# EAGLE design TWI-Verteiler (EAGLE 6.4)
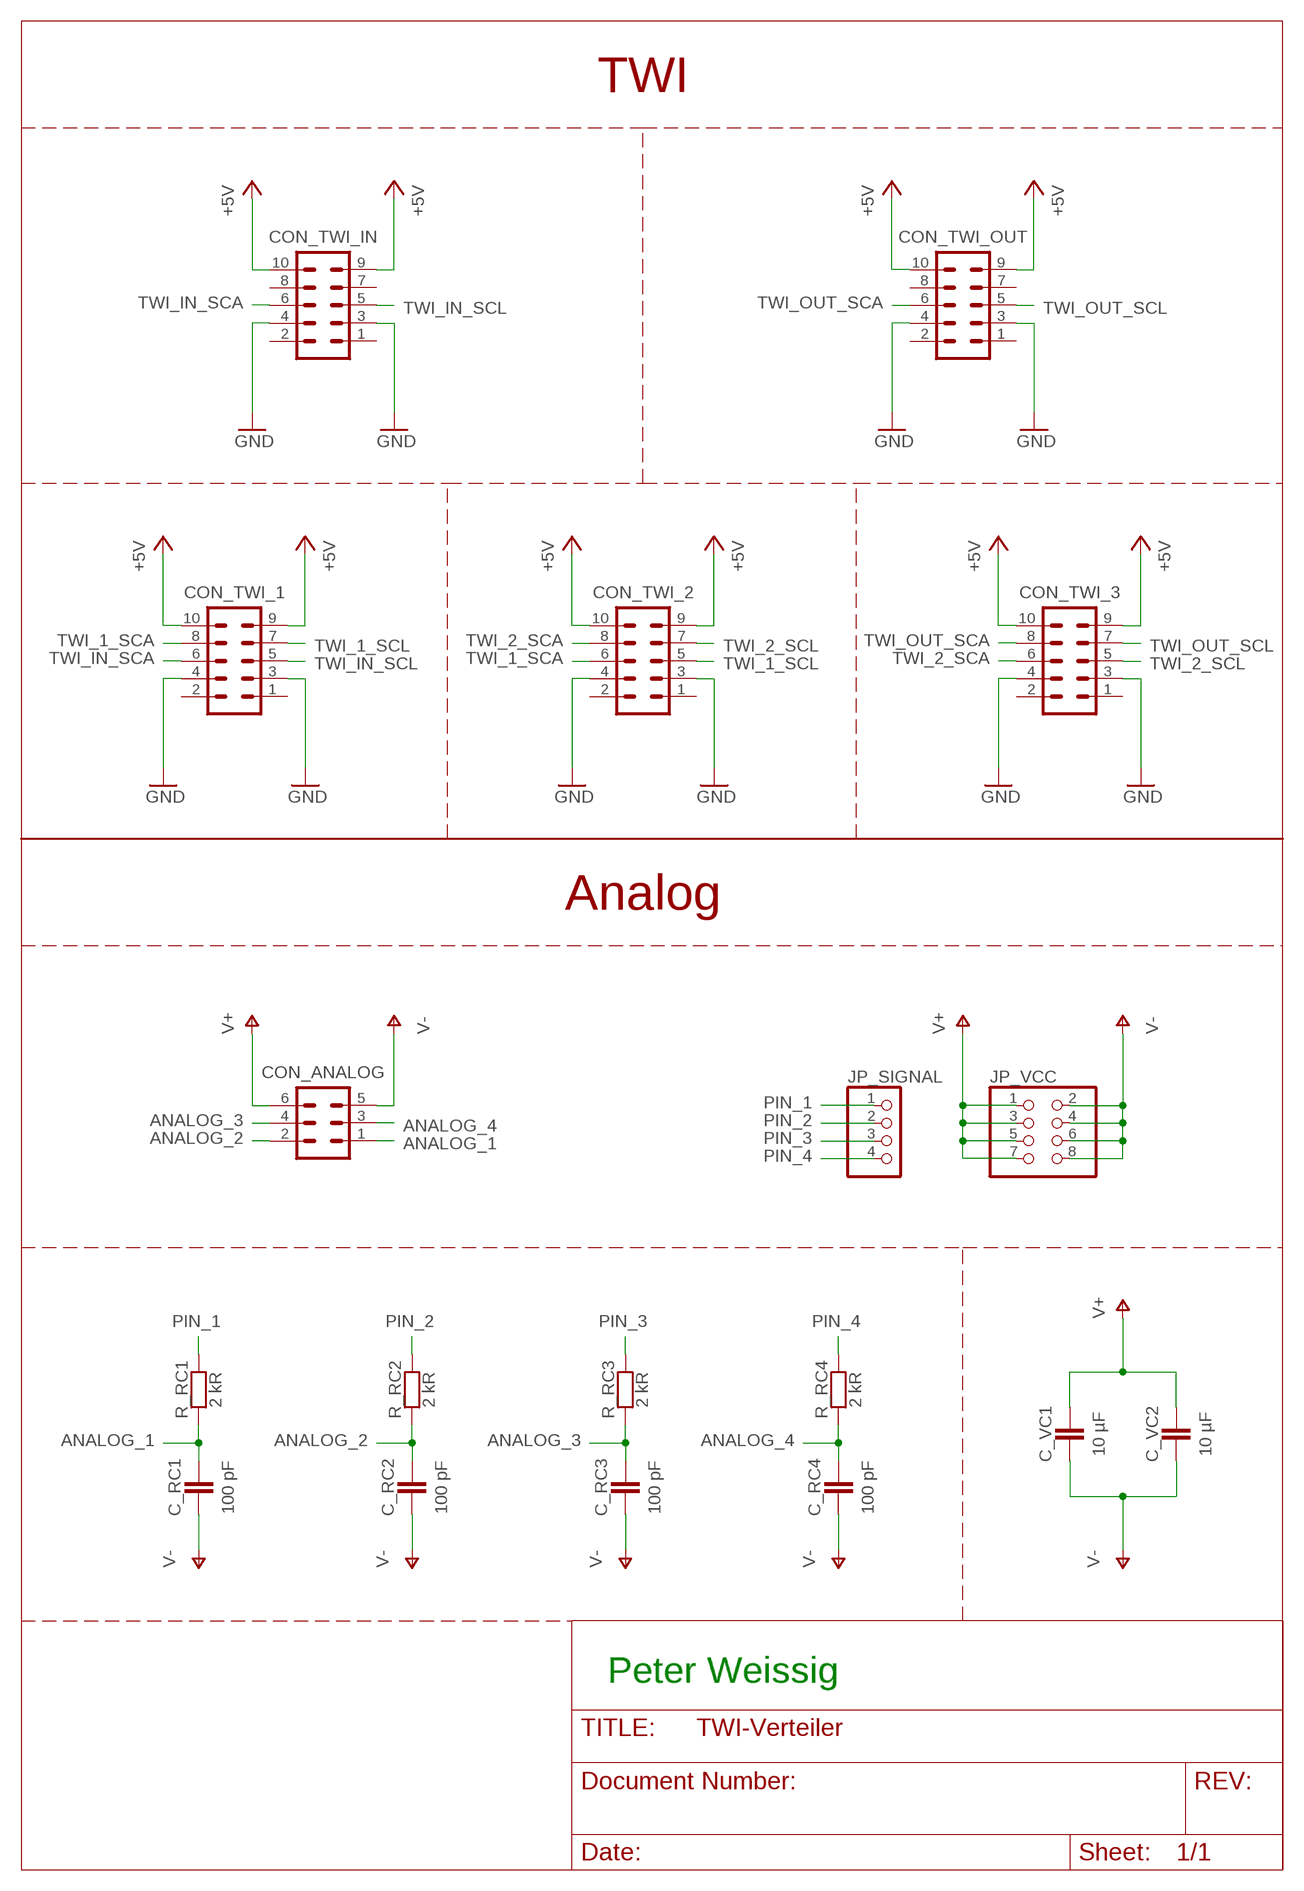
[diagram p0: schematic, sheet 1]

## Parts
C_RC1  100 pF  CAPACITATOR-0603  [SMD_0603]
C_RC2  100 pF  CAPACITATOR-0603  [SMD_0603]
C_RC3  100 pF  CAPACITATOR-0603  [SMD_0603]
C_RC4  100 pF  CAPACITATOR-0603  [SMD_0603]
C_VC1  10 µF  CAPACITATOR-0603  [SMD_0603]
C_VC2  10 µF  CAPACITATOR-0603  [SMD_0603]
CON_ANALOG  STECKER_WANNE_6  [STECKER_WANNE_6]
CON_TWI_1  STECKER_WANNE_10  [STECKER_WANNE_10]
CON_TWI_2  STECKER_WANNE_10  [STECKER_WANNE_10]
CON_TWI_3  STECKER_WANNE_10  [STECKER_WANNE_10]
CON_TWI_IN  STECKER_WANNE_10  [STECKER_WANNE_10]
CON_TWI_OUT  STECKER_WANNE_10  [STECKER_WANNE_10]
JP_SIGNAL  PINHD-1X4  [1X04]
JP_VCC  PINHD-2X4  [2X04]
R_RC1  2 kR  RESISTOR-0603  [SMD_0603]
R_RC2  2 kR  RESISTOR-0603  [SMD_0603]
R_RC3  2 kR  RESISTOR-0603  [SMD_0603]
R_RC4  2 kR  RESISTOR-0603  [SMD_0603]

## Nets
+5V: CON_TWI_1.9 CON_TWI_1.10 CON_TWI_2.9 CON_TWI_2.10 CON_TWI_3.9 CON_TWI_3.10 CON_TWI_IN.9 CON_TWI_IN.10 CON_TWI_OUT.9 CON_TWI_OUT.10
ANALOG_1: C_RC1.1 CON_ANALOG.1 R_RC1.2
ANALOG_2: C_RC2.1 CON_ANALOG.2 R_RC2.2
ANALOG_3: C_RC3.1 CON_ANALOG.4 R_RC3.2
ANALOG_4: C_RC4.1 CON_ANALOG.3 R_RC4.2
GND: CON_TWI_1.3 CON_TWI_1.4 CON_TWI_2.3 CON_TWI_2.4 CON_TWI_3.3 CON_TWI_3.4 CON_TWI_IN.3 CON_TWI_IN.4 CON_TWI_OUT.3 CON_TWI_OUT.4
PIN_1: JP_SIGNAL.1 R_RC1.1
PIN_2: JP_SIGNAL.2 R_RC2.1
PIN_3: JP_SIGNAL.3 R_RC3.1
PIN_4: JP_SIGNAL.4 R_RC4.1
TWI_1_SCA: CON_TWI_1.8 CON_TWI_2.6
TWI_1_SCL: CON_TWI_1.7 CON_TWI_2.5
TWI_2_SCA: CON_TWI_2.8 CON_TWI_3.6
TWI_2_SCL: CON_TWI_2.7 CON_TWI_3.5
TWI_IN_SCA: CON_TWI_1.6 CON_TWI_IN.6
TWI_IN_SCL: CON_TWI_1.5 CON_TWI_IN.5
TWI_OUT_SCA: CON_TWI_3.8 CON_TWI_OUT.6
TWI_OUT_SCL: CON_TWI_3.7 CON_TWI_OUT.5
V+: C_VC1.1 C_VC2.1 CON_ANALOG.6 JP_VCC.1 JP_VCC.3 JP_VCC.5 JP_VCC.7
V-: C_RC1.2 C_RC2.2 C_RC3.2 C_RC4.2 C_VC1.2 C_VC2.2 CON_ANALOG.5 JP_VCC.2 JP_VCC.4 JP_VCC.6 JP_VCC.8
Unconnected: CON_TWI_1.1 CON_TWI_1.2 CON_TWI_2.1 CON_TWI_2.2 CON_TWI_3.1 CON_TWI_3.2 CON_TWI_IN.1 CON_TWI_IN.2 CON_TWI_IN.7 CON_TWI_IN.8 CON_TWI_OUT.1 CON_TWI_OUT.2 CON_TWI_OUT.7 CON_TWI_OUT.8

## Notes on the sheet
- TWI
- Analog
- Peter Weissig

## Library data of the parts
C_RC1-C_RC4 C_VC1 C_VC2 = robo_ag:CAPACITATOR: Kondensator
CON_ANALOG = robo_ag:STECKER_WANNE_6: Stecker; REICHELT: WSL 6G
CON_TWI_1-CON_TWI_3 CON_TWI_IN CON_TWI_OUT = robo_ag:STECKER_WANNE_10: Stecker; REICHELT: WSL 10G
JP_SIGNAL = pinhead:PINHD-1X4: PIN HEADER
JP_VCC = pinhead:PINHD-2X4: PIN HEADER
R_RC1-R_RC4 = robo_ag:RESISTOR: Widerstand

## Board
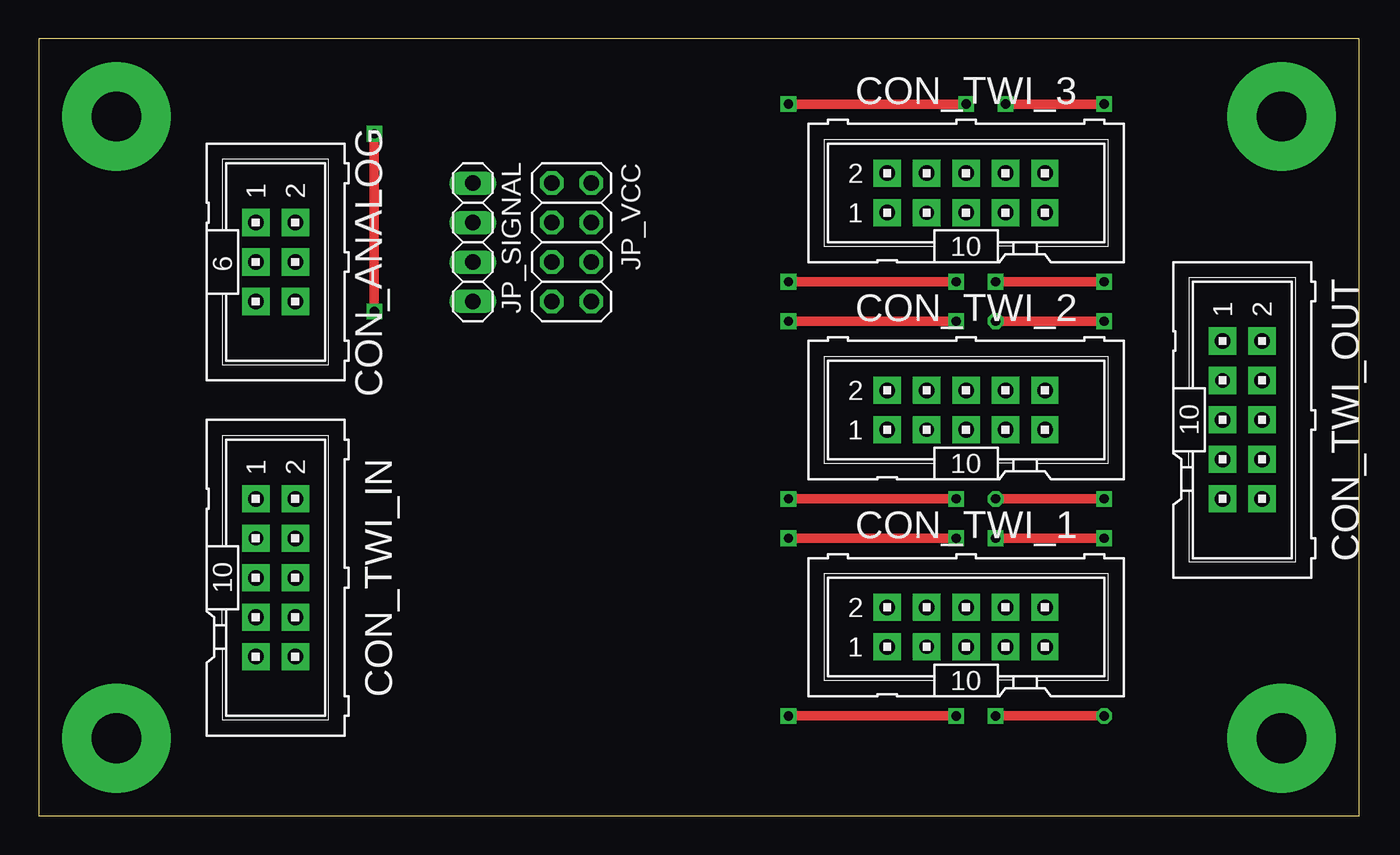
[diagram p1: board, top side]
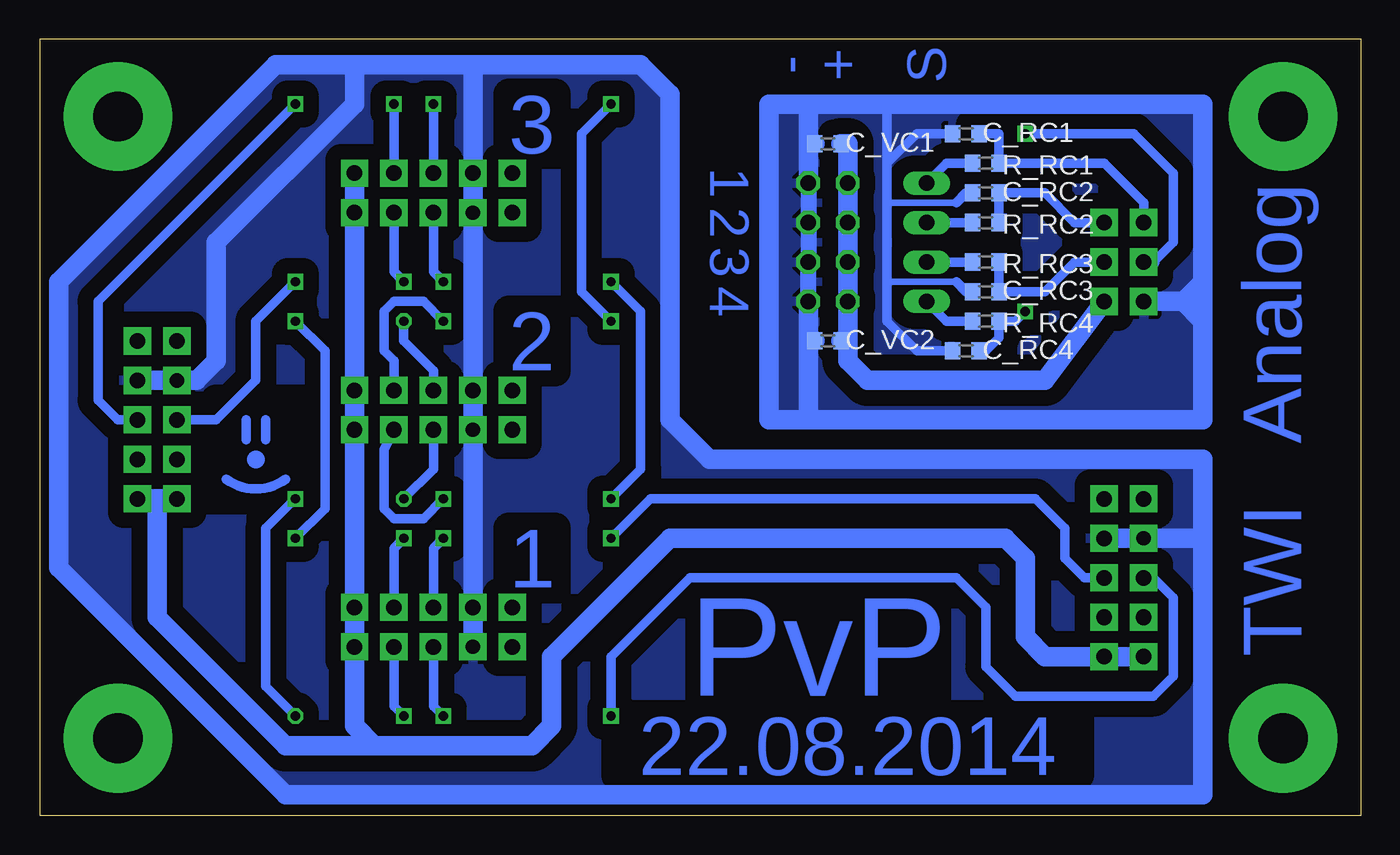
[diagram p2: board, bottom side, seen from below]

Size 85 x 50 mm. Coordinates in mm from the lower left corner, seen from the top.
Outline: 0,0 85,0 85,50 0,50 0,0
Copper layers (1*16): Top 0.035mm / dielectric 1.5mm / Bottom 0.035mm
Design rules "default": minimum track width 10mil, minimum drill 24mil, track to track 8mil, track to pad 8mil, pad to pad 8mil, via to via 8mil, smd to smd 8mil, copper to edge 40mil, drill to drill 8mil, minimum pad ring 10mil, minimum via ring 8mil, stop-mask expansion 4mil, vias tented up to drill 0mil, thermal gap 10mil
bRestrict: area 68.6,20.4 to 73.7,26.8

### Footprints (pad centres in the part's own frame; a part is rotated, then mirrored left to right if it is on the bottom)
SMD_0603 = smd 1 x 1.1: 1 -0.85,0; 2 0.85,0
STECKER_WANNE_6 = drill 1 pad 1.75 square: 1 -2.54,-1.27; 2 -2.54,1.27; 3 0,-1.27; 4 0,1.27; 5 2.54,-1.27; 6 2.54,1.27
STECKER_WANNE_10 = drill 1 pad 1.75 square: 1 -5.08,-1.27; 2 -5.08,1.27; 4 -2.54,1.27; 5 0,-1.27; 6 0,1.27; 7 2.54,-1.27; 8 2.54,1.27; 9 5.08,-1.27; 10 5.08,1.27 | drill 0.914 pad 1.75 square: 3 -2.54,-1.27
1X04 = drill 1.016 long: 1 -3.81,0; 2 -1.27,0; 3 1.27,0; 4 3.81,0
2X04 = drill 1.016 octagon: 1 -3.81,-1.27; 2 -3.81,1.27; 3 -1.27,-1.27; 4 -1.27,1.27; 5 1.27,-1.27; 6 1.27,1.27; 7 3.81,-1.27; 8 3.81,1.27

### Placement (x,y rotation side)
C_RC1  25.4,43.9 180 bottom
C_RC2  24.13,40.09 180 bottom
C_RC3  24.13,33.73 180 bottom
C_RC4  25.4,29.92 180 bottom
C_VC1  34.29,43.26 180 bottom
C_VC2  34.29,30.56 180 bottom
CON_ANALOG  15.24,35.64 270 top
CON_TWI_1  59.69,12.14 0 top
CON_TWI_2  59.69,26.11 0 top
CON_TWI_3  59.69,40.09 0 top
CON_TWI_IN  15.24,15.32 270 top
CON_TWI_OUT  77.47,25.48 270 top
JP_SIGNAL  27.94,36.91 270 top
JP_VCC  34.29,36.91 270 top
R_RC1  24.13,41.99 0 bottom
R_RC2  24.13,38.18 0 bottom
R_RC3  24.13,35.64 0 bottom
R_RC4  24.13,31.83 0 bottom

### Tracks (layer width: path | path; a pad name or v marks a point on that pad's centre or on a via)
+5V
  Bottom 1.27: 77.47,20.4 CON_TWI_OUT.10 | CON_TWI_3.10 CON_TWI_3.9 CON_TWI_2.10 CON_TWI_2.9 CON_TWI_1.10 CON_TWI_1.9 64.77,5.79 63.5,4.53 | CON_TWI_IN.9 CON_TWI_IN.10 20.32,10.24 21.59,11.51 21.59,16.59 22.86,17.86 44.45,17.86 52.07,10.24 52.07,5.79 53.34,4.53 63.5,4.53 | CON_TWI_OUT.9 77.47,20.4 | 77.47,20.4 77.47,12.78 69.22,4.53 63.5,4.53
ANALOG_1
  Bottom 0.61: CON_ANALOG.1 13.97,39.45 16.51,41.99 R_RC1.2 23.28,43.9 C_RC1.1
ANALOG_2
  Bottom 0.61: CON_ANALOG.2 18.41,38.18 20.32,40.09 C_RC2.1 R_RC2.2
ANALOG_3
  Bottom 0.61: CON_ANALOG.4 18.41,35.64 20.32,33.73 C_RC3.1 R_RC3.2
ANALOG_4  (via drill 0.6)
  Top 0.61: v21.59,32.47 v21.59,43.9
  Bottom 0.61: C_RC4.1 24.13,29.92 23.28,30.77 R_RC4.2 22.23,31.83 v21.59,32.47 | v21.59,43.9 14.61,43.9 12.06,41.35 12.06,36.91 13.34,35.64
  Bottom 0.813: CON_ANALOG.3 13.34,35.64
GND
  Bottom 1.27: 57.15,48.34 46.35,48.34 44.45,46.44 44.45,25.48 41.91,22.94 10.16,22.94 10.16,17.86 | 57.15,48.34 64.77,48.34 | 64.77,48.34 69.85,48.34 83.82,34.37 83.82,15.95 69.22,1.35 10.16,1.35 10.16,17.86 | CON_TWI_IN.4 CON_TWI_IN.3 10.16,17.86 | CON_TWI_1.3 CON_TWI_1.4 CON_TWI_2.3 CON_TWI_2.4 CON_TWI_3.3 CON_TWI_3.4 57.15,48.34 | CON_TWI_OUT.4 CON_TWI_OUT.3 74.93,28.02 73.66,29.29 73.66,36.91 64.77,45.8 64.77,48.34
  pour Bottom (isolate 1.016): 10.16,1.35 10.16,22.94 41.91,22.94 44.45,25.48 44.45,46.44 46.35,48.34 69.85,48.34 83.82,34.37 83.82,15.95 69.22,1.35
N$1
  Bottom 0.61: 70.48,25.48 70.48,24.21
N$2  (via drill 3.2 pad 7)
  other vias: 5,45
N$3  (via drill 3.2 pad 7)
  other vias: 5,5
N$4  (via drill 3.2 pad 7)
  other vias: 80,5
N$5  (via drill 3.2 pad 7)
  other vias: 80,45
N$6
  Bottom 0.61: 71.75,25.48 71.75,24.21
N$7
  Bottom 0.61: 73.03,21.67 arc-73 69.22,21.67
PIN_1
  Bottom 0.61: R_RC1.1 26.67,41.99 JP_SIGNAL.1
PIN_2
  Bottom 0.61: R_RC2.1 JP_SIGNAL.2
PIN_3
  Bottom 0.61: R_RC3.1 JP_SIGNAL.3
PIN_4
  Bottom 0.61: R_RC4.1 26.67,31.83 JP_SIGNAL.4
TWI_1_SCA  (via drill 0.6)
  Top 0.61: v61.59,17.86 v68.58,17.86 | v68.58,31.83 v61.59,31.83
  Bottom 0.61: CON_TWI_1.8 62.23,17.23 v61.59,17.86 | CON_TWI_2.6 59.69,28.66 61.59,30.56 v61.59,31.83 | v68.58,31.83 66.67,29.92 66.67,19.77 v68.58,17.86
TWI_1_SCL  (via drill 0.6)
  Top 0.61: v61.59,20.4 v68.58,20.4 | v68.58,6.43 v61.59,6.43
  Bottom 0.61: CON_TWI_1.7 62.23,7.06 v61.59,6.43 | CON_TWI_2.5 59.69,22.3 v61.59,20.4 | v68.58,6.43 70.48,8.34 70.48,18.5 v68.58,20.4
TWI_2_SCA  (via drill 0.6)
  Top 0.61: v59.05,31.83 v48.26,31.83 | v48.26,45.8 v59.69,45.8
  Bottom 0.61: v59.69,45.8 CON_TWI_3.6 | v48.26,31.83 50.16,33.73 50.16,43.9 v48.26,45.8 | CON_TWI_2.8 62.23,29.29 62.87,29.92 62.87,32.47 62.23,33.1 60.33,33.1 v59.05,31.83
TWI_2_SCL  (via drill 0.6)
  Top 0.61: v59.05,20.4 v48.26,20.4 | v48.26,34.37 v59.05,34.37
  Bottom 0.61: v59.05,34.37 59.69,35.01 CON_TWI_3.5 | v59.05,20.4 60.33,19.13 62.23,19.13 62.87,19.77 62.87,23.57 CON_TWI_2.7 | v48.26,20.4 46.35,22.3 46.35,32.47 v48.26,34.37
TWI_IN_SCA  (via drill 0.6)
  Top 0.61: v59.05,17.86 v48.26,17.86
  Bottom 0.61: v48.26,17.86 45.72,20.4 20.95,20.4 19.05,18.5 19.05,16.59 17.78,15.32 CON_TWI_IN.6 | CON_TWI_1.6 59.69,17.23 v59.05,17.86
TWI_IN_SCL  (via drill 0.6)
  Top 0.61: v59.05,6.43 v48.26,6.43
  Bottom 0.61: v48.26,6.43 48.26,10.24 43.18,15.32 26.04,15.32 24.13,13.41 24.13,9.61 22.23,7.7 13.34,7.7 12.06,8.97 12.06,14.05 13.34,15.32 CON_TWI_IN.5 | CON_TWI_1.5 59.69,7.06 v59.05,6.43
TWI_OUT_SCA  (via drill 0.6)
  Top 0.61: v62.23,45.8 v68.58,45.8
  Bottom 0.61: CON_TWI_3.8 v62.23,45.8 | v68.58,45.8 81.28,33.1 81.28,26.75 80.01,25.48 CON_TWI_OUT.6
TWI_OUT_SCL  (via drill 0.6)
  Top 0.61: v68.58,34.37 v61.59,34.37
  Bottom 0.61: CON_TWI_OUT.5 73.66,25.48 71.12,28.02 71.12,31.83 v68.58,34.37 | v61.59,34.37 62.23,35.01 CON_TWI_3.7
V+
  Bottom 1.27: C_VC1.1 33.02,43.26 JP_VCC.1 JP_VCC.3 JP_VCC.5 JP_VCC.7 33.02,30.56 | C_VC2.1 33.02,30.56 | CON_ANALOG.6 20.32,28.02 31.75,28.02 33.02,29.29 33.02,30.56
V-
  Bottom 0.406: C_RC3.2 25.4,33.73 | 26.04,34.37 30.48,34.37 | C_RC2.2 25.4,40.09 | 26.04,39.45 30.48,39.45
  Bottom 0.61: C_RC1.2 28.57,43.9 30.48,41.99 | 25.4,33.73 26.04,34.37 | 25.4,40.09 26.04,39.45 | C_RC4.2 28.57,29.92 30.48,31.83 30.48,34.37 30.48,39.45 30.48,41.99 | 30.48,41.99 30.48,45.8
  Bottom 1.016: JP_VCC.8 JP_VCC.6 JP_VCC.4 JP_VCC.2
  Bottom 1.27: 35.56,45.8 38.1,45.8 38.1,25.48 35.56,25.48 | 35.56,45.8 30.48,45.8 10.16,45.8 10.16,34.37 | 35.56,25.48 10.16,25.48 10.16,31.83 | CON_ANALOG.5 11.43,33.1 | 11.43,33.1 10.16,34.37 | 10.16,34.37 10.16,31.83 | 11.43,33.1 10.16,31.83 | 35.56,30.56 JP_VCC.8 | C_VC1.2 35.56,43.26 | 35.56,43.26 JP_VCC.2 | 35.56,43.26 35.56,45.8 | C_VC2.2 35.56,30.56 | 35.56,30.56 35.56,25.48
  pour Bottom (isolate 1.016): 10.16,45.8 10.16,25.48 38.1,25.48 38.1,45.8
(copper drawn outside any net)
  shapes: Bottom circle x1

### Text on the board
Bottom: S | + | - | 3 | Analog | 1 | 2 | 3 | 4 | 2 | 1 | TWI | PvP | 22.08.2014